# EAGLE design ESPWriter (EAGLE 9.6.2)
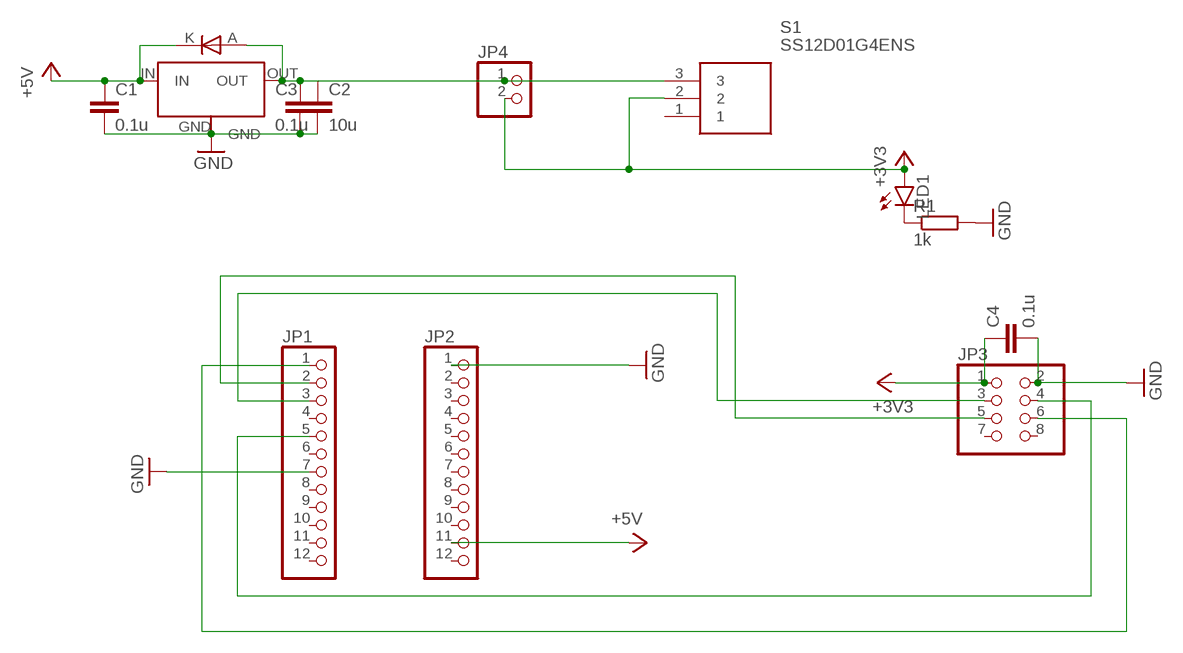
[diagram p0: schematic, sheet 1]

## Parts
C1  0.1u  C-EUC0603  [C0603]
C2  10u  C-EUC0603  [C0603]
C3  0.1u  C-EUC0603  [C0603]
C4  0.1u  C-EUC0603  [C0603]
JP1  PINHD-1X12  [1X12]
JP2  PINHD-1X12  [1X12]
JP3  PINHD-2X4  [2X04]
JP4  PINHD-1X2  [1X02]
LED1  LEDCHIPLED_0603  [CHIPLED_0603]
R1  1k  R-EU_R0603  [R0603]
S1  SS12D01G4ENS  [SS12D01G4]
U$5  3v3 reg  NJM2391DL1-33  [NJM2391DL1-33]
U$6  SS2040FL  [SS2040FL]

## Nets
+3V3: C4.1 JP3.1 JP4.2 LED1.A S1.2
+5V: C1.1 JP2.11 U$5.IN U$6.K
GND: C1.2 C2.2 C3.2 C4.2 JP1.7 JP2.1 JP3.2 R1.2 U$5.GND
N$1: C2.1 C3.1 JP4.1 S1.3 U$5.OUT U$6.A
N$2: JP1.3 JP3.3
N$3: JP1.2 JP3.5
N$4: JP1.5 JP3.4
N$5: JP1.1 JP3.6
N$6: LED1.C R1.1
Unconnected: JP1.4 JP1.6 JP1.8 JP1.9 JP1.10 JP1.11 JP1.12 JP2.2 JP2.3 JP2.4 JP2.5 JP2.6 JP2.7 JP2.8 JP2.9 JP2.10 JP2.12 JP3.7 JP3.8 S1.1

## Library data of the parts
C1-C4 = rcl:C-EU: CAPACITOR, European symbol; SPICEPREFIX: C
JP1 JP2 = pinhead:PINHD-1X12: PIN HEADER
JP3 = pinhead:PINHD-2X4: PIN HEADER
JP4 = pinhead:PINHD-1X2: PIN HEADER
LED1 = led:LED: LED OSRAM: - CHIPLED LG R971, LG N971, LY N971, LG Q971, LY Q971, LO R971, LY R971 LH N974, LH R974 LS Q976, LO Q976, LY Q976 LO Q996 - Hyper CHIPLED LW Q18S LB Q993, LB Q99A, LB R99A - SideLED LS A670, LO A670, LY A670, LG A670, LP A670 LB A673, LV A673, LT A673, LW A673 LH A674 LY A675 LS A676, LA A676, LO A676, LY A676, LW A676 LS A679, LY A679, LG A679 - Hyper Micro SIDELED® LS Y876, LA Y876, LO Y876, LY Y876 LT Y87S - SmartLED LW L88C, LW L88S LB L89C, LB L89S, LG L890 LS L89K, LO L89K, LY L89K LS L896, LA L896, LO L896, LY L896 - TOPLED LS T670, LO T670, LY T670, LG T670, LP T670 LSG T670, LSP T670, LSY T670, LOP T670, LYG T670 LG T671, LOG T671, LSG T671 LB T673, LV T673, LT T673, LW T673 LH T674 LS T676, LA T676, LO T676, LY T676, LB T676, LH T676, LSB T676, LW T676 LB T67C, LV T67C, LT T67C, LS T67K, LO T67K, LY T67K, LW E67C LS E67B, LA E67B, LO E67B, LY E67B, LB E67C, LV E67C, LT E67C LW T67C LS T679, LY T679, LG T679 LS T770, LO T770, LY T770, LG T770, LP T770 LB T773, LV T773, LT T773, LW T773 LH T774 LS E675, LA E675, LY E675, LS T675 LS T776, LA T776, LO T776, LY T776, LB T776 LHGB T686 LT T68C, LB T68C - Hyper Mini TOPLED® LB M676 - Mini TOPLED Santana® LG M470 LS M47K, LO M47K, LY M47K Source: http://www.osram.convergy.de LUXEON: - LUMILED® LXK2-PW12-R00, LXK2-PW12-S00, LXK2-PW14-U00, LXK2-PW14-V00 LXK2-PM12-R00, LXK2-PM12-S00, LXK2-PM14-U00 LXK2-PE12-Q00, LXK2-PE12-R00, LXK2-PE12-S00, LXK2-PE14-T00, LXK2-PE14-U00 LXK2-PB12-K00, LXK2-PB12-L00, LXK2-PB12-M00, LXK2-PB14-N00, LXK2-PB14-P00, LXK2-PB14-Q00 LXK2-PR12-L00, LXK2-PR12-M00, LXK2-PR14-Q00, LXK2-PR14-R00 LXK2-PD12-Q00, LXK2-PD12-R00, LXK2-PD12-S00 LXK2-PH12-R00, LXK2-PH12-S00 LXK2-PL12-P00, LXK2-PL12-Q00, LXK2-PL12-R00 Source: www.luxeon.com KINGBRIGHT: KA-3528ASYC Source: www.kingbright.com
R1 = rcl:R-EU_: RESISTOR, European symbol; SPICEPREFIX: R
S1 = SamacSys_Parts:SS12D01G4ENS: slide switch Source: Datasheet <http://akizukidenshi.com/download/SS12D01G4.pdf>; ARROW_PART_NUMBER: SS12D01G4ENS; ARROW_PRICE-STOCK: https://www.arrow.com/en/products/ss12d01g4ens/ck; DESCRIPTION: slide switch; HEIGHT: mm; MANUFACTURER_NAME: C & K COMPONENTS; MANUFACTURER_PART_NUMBER: SS12D01G4ENS; MOUSER_PART_NUMBER: 611-SS12D01G4ENS; MOUSER_PRICE-STOCK: https://www.mouser.co.uk/ProductDetail/CK/SS12D01G4ENS?qs=Gufeu08L%2Fl0fFWLYO7A1Xw%3D%3D
U$5 = CREATE_sensor_dip:NJM2391DL1-33
U$6 = CREATE_sensor_dip:SS2040FL

## Board
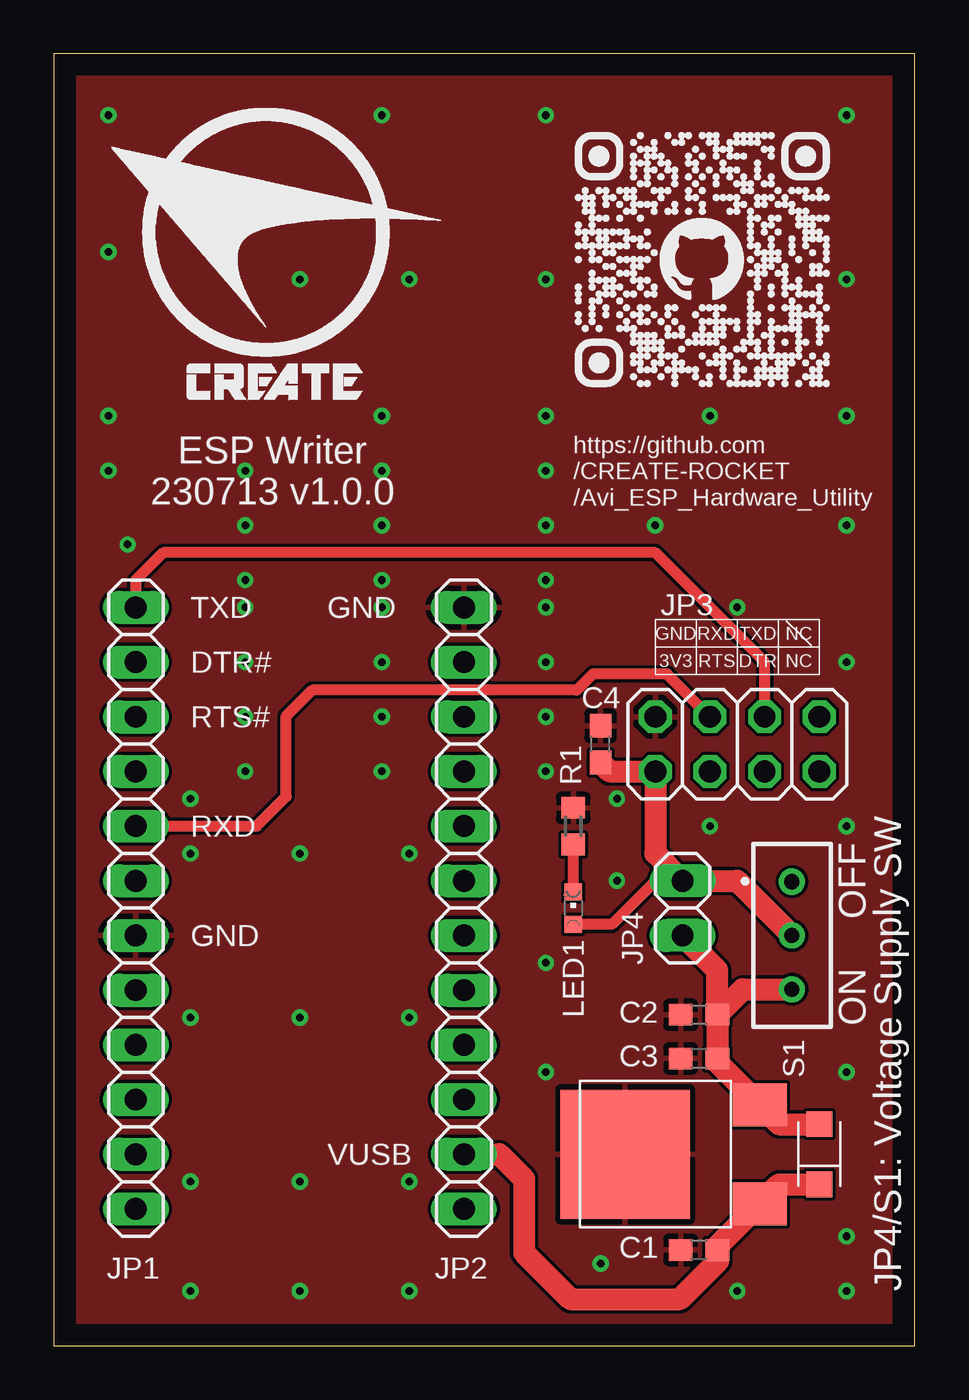
[diagram p1: board, top side]
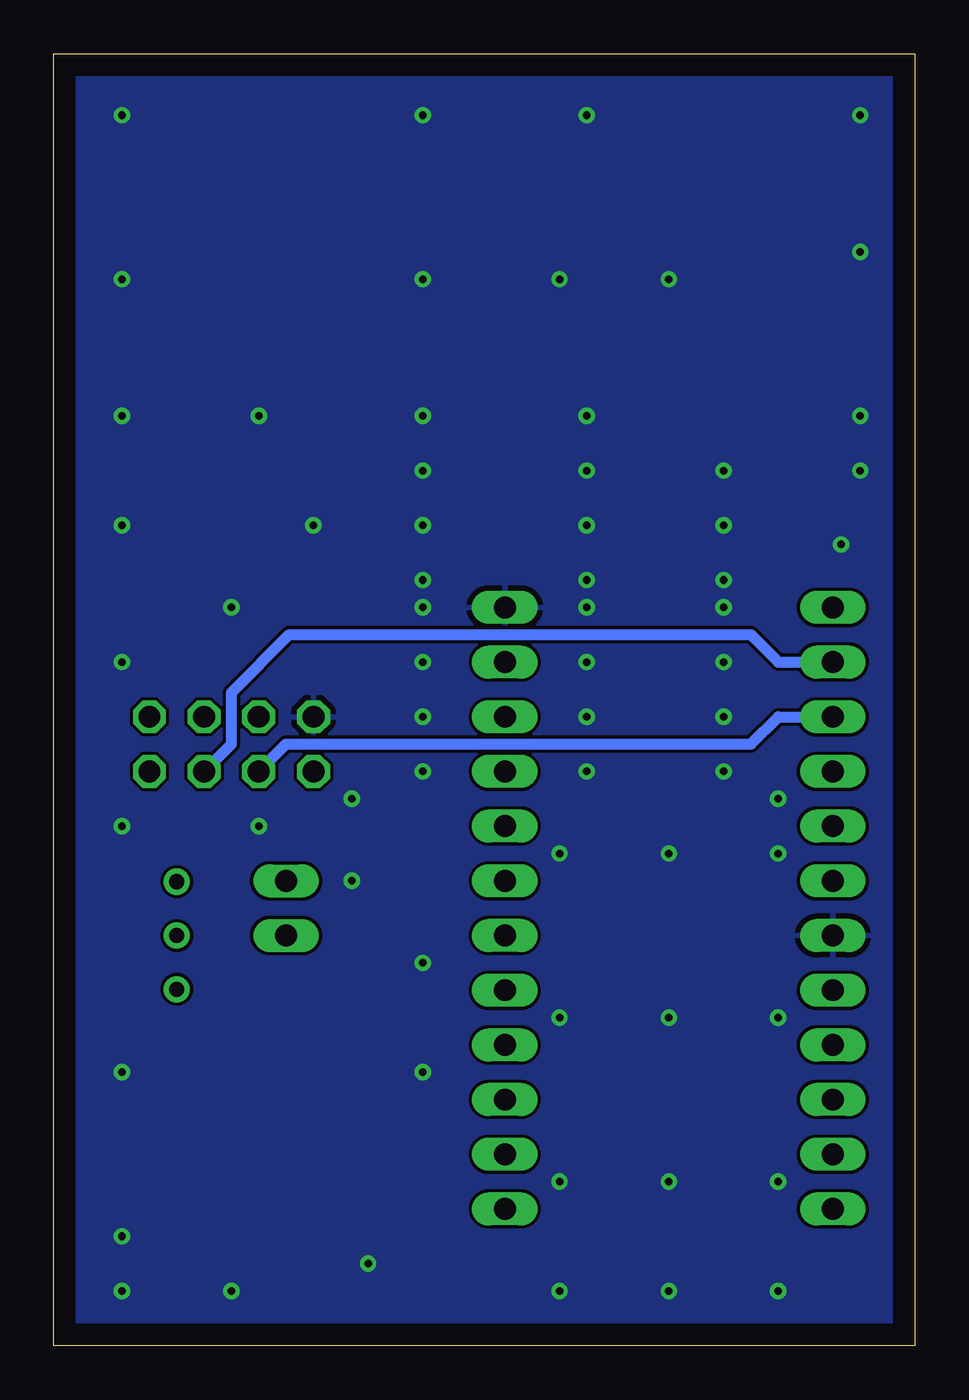
[diagram p2: board, bottom side, seen from below]

Size 40 x 60 mm. Coordinates in mm from the lower left corner, seen from the top.
Outline: 0,0 40,0 40,60 0,60 0,0
Copper layers (1*16): Top 0.035mm / dielectric 1.5mm / Bottom 0.035mm
Design rules "default *": minimum track width 6mil, minimum drill 0.35mm, track to track 6mil, track to pad 6mil, pad to pad 6mil, via to via 6mil, smd to smd 6mil, copper to edge 40mil, drill to drill 6mil, minimum pad ring 10mil, minimum via ring 8mil, stop-mask expansion 4mil, vias tented up to drill 4mm, thermal gap 10mil

### Footprints (pad centres in the part's own frame; a part is rotated, then mirrored left to right if it is on the bottom)
C0603 = smd 1.1 x 1: 1 -0.85,0; 2 0.85,0
1X12 = drill 1.016 long: 1 -13.97,0; 2 -11.43,0; 3 -8.89,0; 4 -6.35,0; 5 -3.81,0; 6 -1.27,0; 7 1.27,0; 8 3.81,0; 9 6.35,0; 10 8.89,0; 11 11.43,0; 12 13.97,0
2X04 = drill 1.016 octagon: 1 -3.81,-1.27; 2 -3.81,1.27; 3 -1.27,-1.27; 4 -1.27,1.27; 5 1.27,-1.27; 6 1.27,1.27; 7 3.81,-1.27; 8 3.81,1.27
1X02 = drill 1.016 long: 1 -1.27,0; 2 1.27,0
CHIPLED_0603 = smd 0.8 x 0.8: A 0,-0.75; C 0,0.75
R0603 = smd 1 x 1.1: 1 -0.85,0; 2 0.85,0
SS12D01G4 = drill 0.7 pad 1.2: 1 2.5,0; 2 0,0; 3 -2.5,0
NJM2391DL1-33 = smd 6 x 6: GND 0,1.4 | smd 2 x 2.5: IN -2.3,-4.85; OUT 2.3,-4.85
SS2040FL = smd 1.2 x 1.2: A 1.4,0; K -1.4,0

### Placement (x,y rotation side)
C1  29.97,4.45 180 top
C2  29.97,15.37 180 top
C3  29.97,13.34 180 top
C4  25.4,27.94 90 top
JP1  3.81,20.32 270 top
JP2  19.05,20.32 270 top
JP3  31.75,27.94 0 top
JP4  29.21,20.32 90 top
LED1  24.13,20.32 0 top
R1  24.13,24.13 90 top
S1  34.29,19.05 90 top
U$5  27.94,8.89 90 top
U$6  35.56,8.89 90 top

### Tracks (layer width: path | path; a pad name or v marks a point on that pad's centre or on a via)
+3V3
  Top 0.508: JP4.2 27.94,21.59 25.92,19.57 LED1.A
  Top 1.016: S1.2 31.75,21.59 JP4.2 27.94,22.86 JP3.1 25.82,26.67 C4.1
+5V
  Top 1.016: JP2.11 20.7,8.89 21.84,7.75 21.84,4.32 24,2.16 29.08,2.16 30.86,3.94 30.86,4.41 C1.1 30.82,4.62 U$5.IN 33.69,7.49 U$6.K
GND  (via drill 0.35)
  other vias: 2.54,57.15 36.83,57.15 2.54,50.8 2.54,43.18 15.24,57.15 22.86,57.15 22.86,43.18 15.24,43.18 11.43,49.53 22.86,49.53 16.51,49.53 36.83,49.53 36.83,43.18 30.48,43.18 22.86,40.64 22.86,38.1 15.24,38.1 15.24,40.64 2.54,40.64 3.43,37.21 8.89,38.1 8.89,40.64 8.89,35.56 15.24,35.56 15.24,34.29 8.89,34.29 8.89,31.75 15.24,31.75 15.24,29.21 8.89,29.21 8.89,26.67 15.24,26.67 6.35,25.4 6.35,22.86 6.35,15.24 6.35,7.62 6.35,2.54 16.51,2.54 16.51,7.62 16.51,15.24 16.51,22.86 22.86,35.56 22.86,34.29 22.86,31.75 22.86,29.21 22.86,26.67 22.86,17.78 26.16,25.4 26.16,21.59 30.48,24.13 36.83,24.13 36.83,31.75 27.94,38.1 31.75,34.29 36.83,38.1 36.83,12.7 36.83,5.08 36.83,2.54 31.75,2.54 25.4,3.81 22.86,12.7 11.43,22.86 11.43,15.24 11.43,7.62 11.43,2.54
  pour Top: -2.54,63.5 -2.54,-6.35 52.07,-6.35 52.07,39.37 52.07,63.5
  pour Bottom: -6.35,71.12 -6.35,-8.89 -3.81,-8.89 55.88,-8.89 55.88,53.34 55.88,71.12
N$1
  Top 1.016: U$6.A 33.69,10.29 U$5.OUT 30.82,13.16 C3.1 C2.1 | C2.1 32.01,16.55 S1.3 | C2.1 30.82,17.44 JP4.1
N$2
  Bottom 0.508: JP3.3 29.21,27.94 7.62,27.94 6.35,29.21 JP1.3
N$3
  Bottom 0.508: JP3.5 31.75,27.94 31.75,30.33 29.06,33.02 7.62,33.02 6.35,31.75 JP1.2
N$4
  Top 0.508: JP3.4 28.49,31.2 25.05,31.2 24.3,30.45 12,30.45 10.8,29.25 10.8,25.5 9.43,24.13 JP1.5
N$5
  Top 0.508: JP1.1 3.81,35.56 5.08,36.83 27.94,36.83 33.02,31.75 JP3.6
N$6
  Top 0.508: LED1.C R1.1

### Text on the board
tNames: ESP Writer / 230713 v1.0.0 | https://github.com / /CREATE-ROCKET / /Avi_ESP_Hardware_Utility | TXD | GND | GND | RXD | TXD | NC | DTR# | 3V3 | RTS | DTR | NC | RTS# | RXD | OFF | GND | ON | VUSB | JP4/S1: Voltage Supply SW